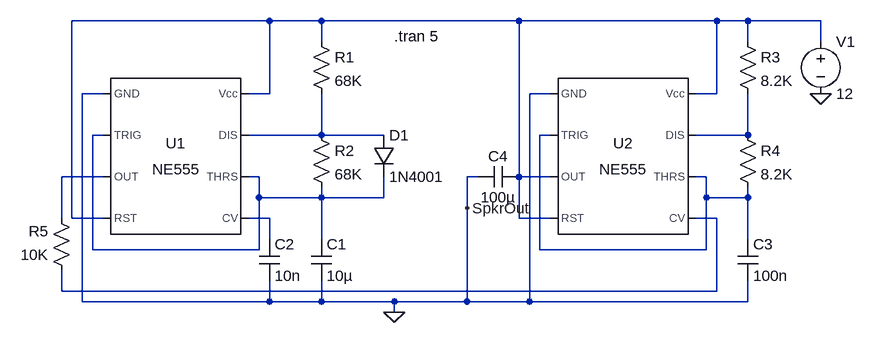
[diagram p0: schematic police siren.asc]
police siren.asc, the LTspice schematic file:
Version 4
SHEET 1 1224 680
WIRE -64 -32 -368 -32
WIRE 16 -32 -64 -32
WIRE 320 -32 16 -32
WIRE 624 -32 320 -32
WIRE 672 -32 624 -32
WIRE 784 -32 672 -32
WIRE 16 0 16 -32
WIRE 672 0 672 -32
WIRE 784 0 784 -32
WIRE -320 80 -352 80
WIRE -64 80 -64 -32
WIRE -64 80 -96 80
WIRE 368 80 336 80
WIRE 624 80 624 -32
WIRE 624 80 592 80
WIRE -320 144 -336 144
WIRE 16 144 16 80
WIRE 16 144 -96 144
WIRE 112 144 16 144
WIRE 368 144 352 144
WIRE 672 144 672 80
WIRE 672 144 592 144
WIRE -320 208 -384 208
WIRE -80 208 -96 208
WIRE 256 208 240 208
WIRE 320 208 320 -32
WIRE 368 208 320 208
WIRE 608 208 592 208
WIRE -80 240 -80 208
WIRE 16 240 16 224
WIRE 16 240 -80 240
WIRE 112 240 112 208
WIRE 112 240 16 240
WIRE 608 240 608 208
WIRE 672 240 672 224
WIRE 672 240 608 240
WIRE 240 256 240 208
WIRE -384 272 -384 208
WIRE -368 272 -368 -32
WIRE -320 272 -368 272
WIRE -64 272 -96 272
WIRE 320 272 320 208
WIRE 368 272 320 272
WIRE 624 272 592 272
WIRE -64 304 -64 272
WIRE 16 304 16 240
WIRE 672 304 672 240
WIRE -336 320 -336 144
WIRE -80 320 -80 240
WIRE -80 320 -336 320
WIRE 352 320 352 144
WIRE 608 320 608 240
WIRE 608 320 352 320
WIRE -384 384 -384 352
WIRE 624 384 624 272
WIRE 624 384 -384 384
WIRE -352 400 -352 80
WIRE -64 400 -64 368
WIRE -64 400 -352 400
WIRE 16 400 16 368
WIRE 16 400 -64 400
WIRE 128 400 16 400
WIRE 240 400 240 256
WIRE 240 400 128 400
WIRE 336 400 336 80
WIRE 336 400 240 400
WIRE 672 400 672 368
WIRE 672 400 336 400
WIRE 128 416 128 400
FLAG 784 80 0
FLAG 240 256 SpkrOut
FLAG 128 416 0
SYMBOL Misc\\NE555 -208 176 R0
SYMATTR InstName U1
SYMBOL Misc\\NE555 480 176 R0
SYMATTR InstName U2
SYMBOL voltage 784 -16 R0
WINDOW 123 0 0 Left 2
WINDOW 39 0 0 Left 2
SYMATTR InstName V1
SYMATTR Value 12
SYMBOL res -368 368 R180
WINDOW 0 36 76 Left 2
WINDOW 3 36 40 Left 2
SYMATTR InstName R5
SYMATTR Value 10K
SYMBOL cap -80 304 R0
SYMATTR InstName C2
SYMATTR Value 10n
SYMBOL res 0 -16 R0
SYMATTR InstName R1
SYMATTR Value 68K
SYMBOL res 0 128 R0
SYMATTR InstName R2
SYMATTR Value 68K
SYMBOL cap 0 304 R0
SYMATTR InstName C1
SYMATTR Value 10µ
SYMBOL diode 96 144 R0
SYMATTR InstName D1
SYMATTR Value 1N4001
SYMBOL res 656 -16 R0
SYMATTR InstName R3
SYMATTR Value 8.2K
SYMBOL res 656 128 R0
SYMATTR InstName R4
SYMATTR Value 8.2K
SYMBOL cap 656 304 R0
SYMATTR InstName C3
SYMATTR Value 100n
SYMBOL cap 256 224 R270
WINDOW 0 32 32 VTop 2
WINDOW 3 0 32 VBottom 2
SYMATTR InstName C4
SYMATTR Value 100µ
TEXT 128 -8 Left 2 !.tran 5

The netlist it stands for:
* police siren.asc
XU1 0 N002 N006 N001 N007 N002 N003 N001 NE555  ; pins GND TRIG OUT RST CV THRS DIS Vcc
XU2 0 N004 N001 N001 N008 N004 N005 N001 NE555  ; pins GND TRIG OUT RST CV THRS DIS Vcc
V1 N001 0 12
R5 N008 N006 10K
C2 N007 0 10n
R1 N001 N003 68K
R2 N003 N002 68K
C1 N002 0 10µ
D1 N003 N002 1N4001
R3 N001 N005 8.2K
R4 N005 N004 8.2K
C3 N004 0 100n
C4 0 N001 100µ
.model D D
.lib standard.dio
.tran 5
.lib NE555.sub
.backanno
.end